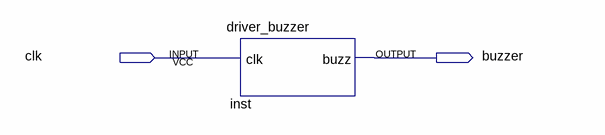
[diagram p0: schematic sheet]
// Quartus schematic test_buzzer.bdf as structural Verilog: 1 symbols, 2 pins
module test_buzzer (
  input  clk,
  output buzzer
);

  driver_buzzer inst (.clk(clk), .buzz(buzzer));
endmodule
